# Altium schematic sheet Tutorial.SchDoc: 555 Timer Alternating LEDs
size Tabloid; DrawnBy: Drawn By; SheetNumber: nn; SheetTotal: pp; PageSetup: Record=PageOptions|CenterHorizontal=True|CenterVertical=True|PrintScale=0.62|XCorrection=1.00|YCorrection=1.00|PrintKind=1|BorderSize=5000000|LeftOffset=0|BottomOffset=0|Orientation=2|PaperLength=1000|PaperWidth=1000|Scale=100|PaperSource=7|PrintQuality=600|MediaType=1|DitherType=10|PaperKind=Letter|PrintScaleMode=1; PageSize: T
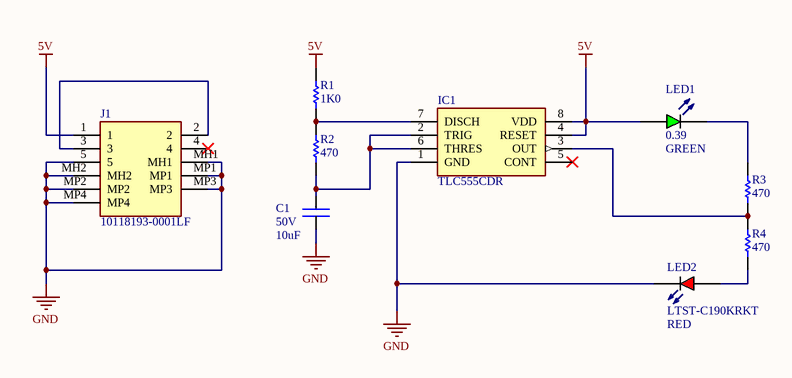
[diagram p0: Tutorial.SchDoc]

## Parts
C1  value 10uF  VOLTAGE: 50V  [CAPC3225X28N]  (hidden comment: CAP CER 10UF 50V X7S 1210)
IC1  TLC555CDR  [SOIC127P600X175-8N]
J1  10118193-0001LF  [101181930001LF]
LED1  value GREEN  MFG_PART_NO: 0.39  [LED LTST-C190KGKT]  (hidden comment: LED GREEN)
LED2  value RED  MFG_PART_NO: LTST-C190KRKT  [LED LTST-C190KRKT]  (hidden comment: LED RED)
R1  value 1K0  [RESC1608X06N]  (hidden comment: RES SMD 1K OHM 1% 1/10W 0603)
R2  value 470  [RESC1608X06N]  (hidden comment: RES SMD 470 OHM 1% 1/10W 0603)
R3  value 470  [RESC1608X06N]  (hidden comment: RES SMD 470 OHM 1% 1/10W 0603)
R4  value 470  [RESC1608X06N]  (hidden comment: RES SMD 470 OHM 1% 1/10W 0603)

## Nets
5V: IC1.4(RESET) IC1.8(VDD) J1.1 LED1.A R1.2
GND: C1.2 IC1.1(GND) J1.5 J1.MH1 J1.MH2 J1.MP1 J1.MP2 J1.MP3 J1.MP4 LED2.K
NetC1_1: C1.1 IC1.2(TRIG) IC1.6(THRES) R2.2
NetIC1_3: IC1.3(OUT) R3.1 R4.2
NetIC1_7: IC1.7(DISCH) R1.1 R2.1
NetJ1_2: J1.2 J1.3
NetLED1_K: LED1.K R3.2
NetLED2_A: LED2.A R4.1

Not connected (* = marked no-connect by the designer): IC1 5(CONT)*; J1 4*

## Notes on the sheet
- Title:
- Project:
- 200 University Ave W
- Size:
- Date:
- DrawnBy:
- Rev:
- Project Lead:
- Sheet
- Dhrumil Parikh
- of
- Waterloo, ON
- N2L 3G1, Canada
- File:

## Library data of the parts
C1 = CAP CER 10UF 50V X7S 1210: MFG_PART_NO: UMK325C7106MM-T; MFG: Taiyo Yuden; TOLERANCE: 20%; COST: 1.14; DIELECTRIC: X7S
IC1 = TLC555CDR: Integrated Circuit; Manufacturer_Name: Texas Instruments; Datasheet Link: http://docs-emea.rs-online.com/webdocs/0cb9/0900766b80cb9d34.pdf; Height: 1.75mm; Manufacturer_Part_Number: TLC555CDR; Mouser Part Number: 595-TLC555CDR; Mouser Price/Stock: https://www.mouser.com/Search/Refine.aspx?Keyword=595-TLC555CDR; RS Part Number: 6624006P; RS Price/Stock: http://uk.rs-online.com/web/p/products/6624006P
J1 = 10118193-0001LF: Connector; Manufacturer_Name: Amphenol; Allied_Number: 70236827; Datasheet Link: https://componentsearchengine.com/Datasheets/1/10118193-0001LF.pdf; Height: 3.1mm; Manufacturer_Part_Number: 10118193-0001LF; Mouser Part Number: 649-10118193-0001LF; Mouser Price/Stock: https://www.mouser.com/Search/Refine.aspx?Keyword=649-10118193-0001LF; RS Part Number: 8632989; RS Price/Stock: http://uk.rs-online.com/web/p/products/8632989; Allied Price/Stock: https://www.alliedelec.com/amphenolicc-10118193-0001lf/70236827/
LED1 = LED GREEN: LED SUPER GREEN CLEAR 0603 SMD; MFG: Lite-On; COST: 0.05
LED2 = LED RED: LED SUPER RED CLEAR 0603 SMD; MFG: Lite-On; COST: 0.39
R1 = RES SMD 1K OHM 1% 1/10W 0603: MFG_PART_NO: RMCF0603FT1K00; MFG: Stackpole; COST: 0.15; TOLERANCE: 1%
R2-R4 = RES SMD 470 OHM 1% 1/10W 0603: MFG_PART_NO: CRGCQ0603J470R; MFG: TE Connectivity Passive Product; COST: 0.15; TOLERANCE: 1%